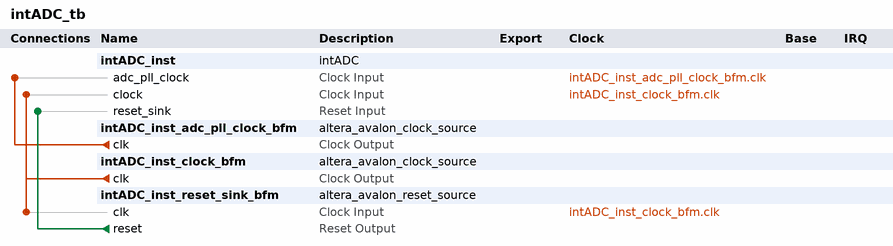
[diagram p0: system contents]
# Platform Designer (Qsys) system intADC_tb, MAX 10 10M50DAF484C7G
# Parameters at their usual value, and those the tool derives, are not listed.
package require -exact qsys 20.1
create_system intADC_tb
set_project_property DEVICE_FAMILY {MAX 10}
set_project_property DEVICE 10M50DAF484C7G

add_instance intADC_inst intADC 1.0

add_instance intADC_inst_adc_pll_clock_bfm altera_avalon_clock_source 20.1

add_instance intADC_inst_clock_bfm altera_avalon_clock_source 20.1

add_instance intADC_inst_reset_sink_bfm altera_avalon_reset_source 20.1
set_instance_parameter_value intADC_inst_reset_sink_bfm ASSERT_HIGH_RESET 0
set_instance_parameter_value intADC_inst_reset_sink_bfm INITIAL_RESET_CYCLES 50

# connections
add_connection intADC_inst_adc_pll_clock_bfm.clk intADC_inst.adc_pll_clock clock
add_connection intADC_inst_clock_bfm.clk intADC_inst.clock clock
add_connection intADC_inst_clock_bfm.clk intADC_inst_reset_sink_bfm.clk clock
add_connection intADC_inst_reset_sink_bfm.reset intADC_inst.reset_sink reset

set_interconnect_requirement {$system} qsys_mm.clockCrossingAdapter HANDSHAKE
set_interconnect_requirement {$system} qsys_mm.enableEccProtection FALSE
set_interconnect_requirement {$system} qsys_mm.insertDefaultSlave FALSE
set_interconnect_requirement {$system} qsys_mm.maxAdditionalLatency 1

save_system intADC_tb.qsys
